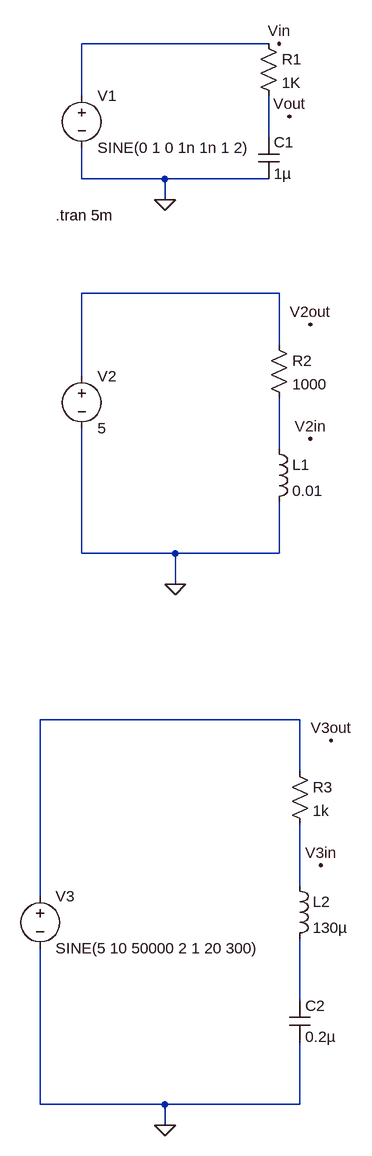
[diagram p0: schematic YUKTHI_USERNAME_Yukthi23.asc]
YUKTHI_USERNAME_Yukthi23.asc, the LTspice schematic file:
Version 4.1
SHEET 1 880 1652
WIRE 336 -32 48 -32
WIRE 48 48 48 -32
WIRE 336 112 336 48
WIRE 48 176 48 128
WIRE 176 176 48 176
WIRE 336 176 176 176
WIRE 176 208 176 176
WIRE 352 352 48 352
WIRE 352 432 352 352
WIRE 48 480 48 352
WIRE 352 592 352 512
WIRE 48 752 48 560
WIRE 192 752 48 752
WIRE 352 752 352 672
WIRE 352 752 192 752
WIRE 192 800 192 752
WIRE 384 1008 -16 1008
WIRE 384 1088 384 1008
WIRE 384 1264 384 1168
WIRE -16 1280 -16 1008
WIRE 384 1440 384 1344
WIRE -16 1600 -16 1360
WIRE 176 1600 -16 1600
WIRE 384 1600 384 1504
WIRE 384 1600 176 1600
WIRE 176 1632 176 1600
FLAG 176 208 0
FLAG 192 800 0
FLAG 176 1632 0
FLAG 368 80 Vout
FLAG 352 -32 Vin
FLAG 400 400 V2out
FLAG 400 576 V2in
FLAG 432 1040 V3out
FLAG 416 1232 V3in
SYMBOL voltage 48 32 R0
WINDOW 123 0 0 Left 0
WINDOW 39 0 0 Left 0
SYMATTR InstName V1
SYMATTR Value SINE(0 1 0 1n 1n 1 2)
SYMBOL res 320 -48 R0
SYMATTR InstName R1
SYMATTR Value 1K
SYMATTR SpiceLine tol=1 pwr=0.1
SYMBOL cap 320 112 R0
WINDOW 3 24 56 Left 2
SYMATTR InstName C1
SYMATTR Value 1µ
SYMATTR Description Capacitor
SYMATTR Type cap
SYMATTR SpiceLine V=16 Irms=0 Rser=11 Lser=0 mfg="AVX" pn="TAJA105K016" type="Tantalum"
SYMBOL voltage 48 464 R0
SYMATTR InstName V2
SYMATTR Value 5
SYMBOL res 336 416 R0
SYMATTR InstName R2
SYMATTR Value 1000
SYMBOL ind 336 576 R0
SYMATTR InstName L1
SYMATTR Value 0.01
SYMBOL ind 368 1248 R0
SYMATTR InstName L2
SYMATTR Value 130µ
SYMBOL res 368 1072 R0
SYMATTR InstName R3
SYMATTR Value 1k
SYMBOL cap 368 1440 R0
SYMATTR InstName C2
SYMATTR Value 0.2µ
SYMBOL voltage -16 1264 R0
WINDOW 123 0 0 Left 0
WINDOW 39 0 0 Left 0
SYMATTR InstName V3
SYMATTR Value SINE(5 10 50000 2 1 20 300)
TEXT 8 232 Left 2 !.tran 5m

The netlist it stands for:
* YUKTHI_USERNAME_Yukthi23.asc
V1 N001 0 SINE(0 1 0 1n 1n 1 2)
R1 N001 N002 1K tol=1 pwr=0.1
C1 N002 0 1µ V=16 Irms=0 Rser=11 Lser=0 mfg="AVX" pn="TAJA105K016" type="Tantalum"
V2 N003 0 5
R2 N003 N004 1000
L1 N004 0 0.01
L2 N006 N007 130µ
R3 N005 N006 1k
C2 N007 0 0.2µ
V3 N005 0 SINE(5 10 50000 2 1 20 300)
.tran 5m
.backanno
.end